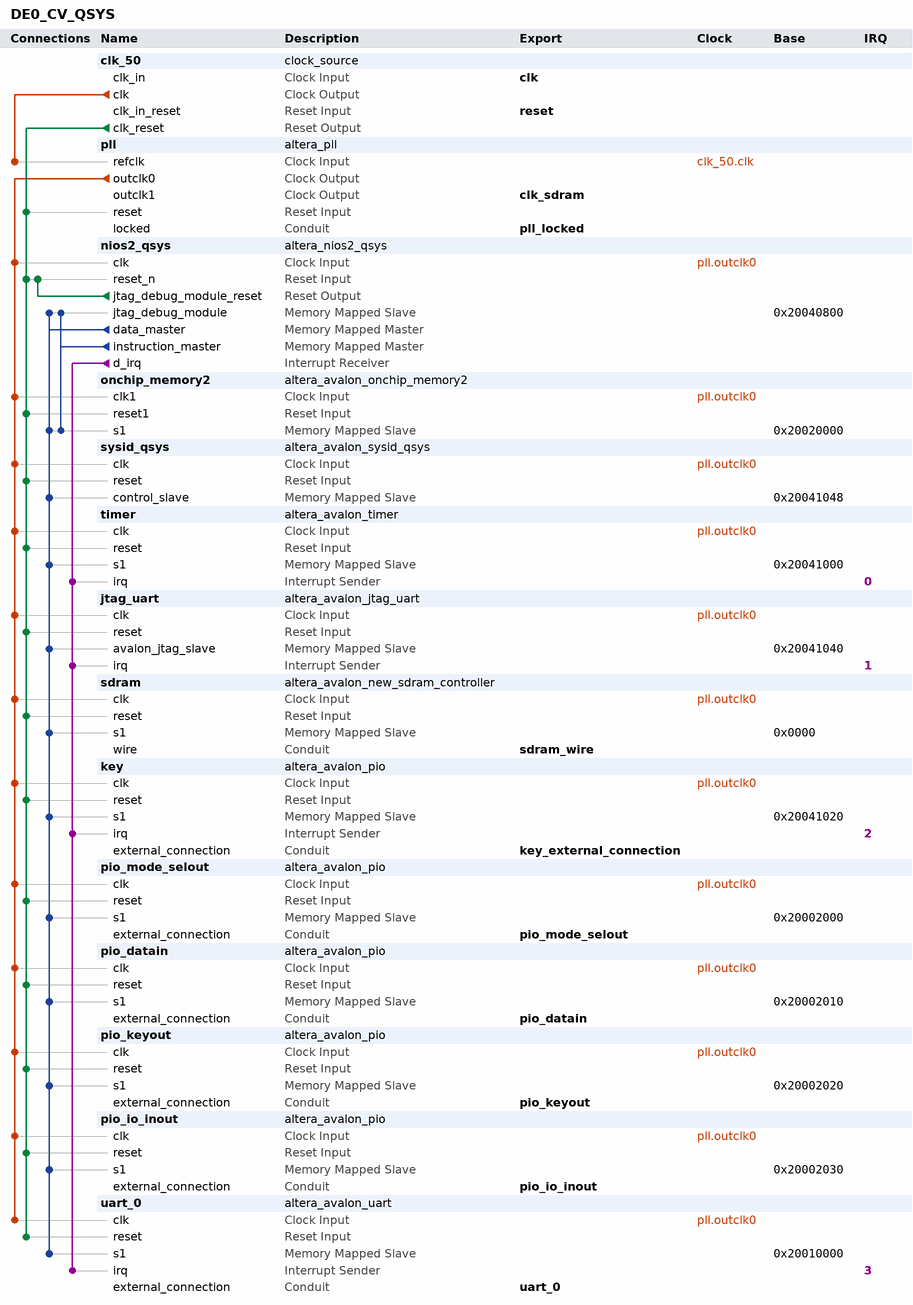
[diagram p0: system contents]
# Platform Designer (Qsys) system DE0_CV_QSYS, Cyclone V 5CEBA4F23C7
# Parameters at their usual value, and those the tool derives, are not listed.
package require -exact qsys 15.1
create_system DE0_CV_QSYS
set_project_property DEVICE_FAMILY {Cyclone V}
set_project_property DEVICE 5CEBA4F23C7

add_instance clk_50 clock_source 15.1
set_instance_parameter_value clk_50 clockFrequency 50000000

add_instance pll altera_pll 15.1
set_instance_parameter_value pll gui_device_speed_grade 2
set_instance_parameter_value pll gui_number_of_clocks 2
set_instance_parameter_value pll gui_operation_mode normal
set_instance_parameter_value pll gui_output_clock_frequency0 143.0
set_instance_parameter_value pll gui_output_clock_frequency1 143.0
set_instance_parameter_value pll gui_phase_shift1 -3800
set_instance_parameter_value pll gui_phase_shift_deg1 -90.0
set_instance_parameter_value pll gui_pll_mode {Integer-N PLL}
set_instance_parameter_value pll gui_reference_clock_frequency 50.0
set_instance_parameter_value pll gui_use_locked true

add_instance nios2_qsys altera_nios2_qsys 15.1
set_instance_parameter_value nios2_qsys breakSlave nios2_qsys.jtag_debug_module
set_instance_parameter_value nios2_qsys exceptionSlave onchip_memory2.s1
set_instance_parameter_value nios2_qsys icache_size 4096
set_instance_parameter_value nios2_qsys impl Tiny
set_instance_parameter_value nios2_qsys mmu_TLBMissExcSlave None
set_instance_parameter_value nios2_qsys resetSlave onchip_memory2.s1
set_instance_parameter_value nios2_qsys resetrequest_enabled true

add_instance onchip_memory2 altera_avalon_onchip_memory2 15.1
set_instance_parameter_value onchip_memory2 dataWidth 32
set_instance_parameter_value onchip_memory2 dualPort false
set_instance_parameter_value onchip_memory2 initMemContent true
set_instance_parameter_value onchip_memory2 initializationFileName onchip_mem.hex
set_instance_parameter_value onchip_memory2 memorySize 128000

add_instance sysid_qsys altera_avalon_sysid_qsys 15.1
set_instance_parameter_value sysid_qsys id 0

add_instance timer altera_avalon_timer 15.1
set_instance_parameter_value timer period 1
set_instance_parameter_value timer periodUnits MSEC

add_instance jtag_uart altera_avalon_jtag_uart 15.1
set_instance_parameter_value jtag_uart simInteractiveOptions NO_INTERACTIVE_WINDOWS

add_instance sdram altera_avalon_new_sdram_controller 15.1
set_instance_parameter_value sdram TAC 5.4
set_instance_parameter_value sdram TRCD 15.0
set_instance_parameter_value sdram TRP 15.0
set_instance_parameter_value sdram casLatency 3
set_instance_parameter_value sdram columnWidth 10
set_instance_parameter_value sdram dataWidth 16
set_instance_parameter_value sdram generateSimulationModel true
set_instance_parameter_value sdram model single_Micron_MT48LC4M32B2_7_chip
set_instance_parameter_value sdram numberOfBanks 4
set_instance_parameter_value sdram numberOfChipSelects 1
set_instance_parameter_value sdram powerUpDelay 100.0
set_instance_parameter_value sdram refreshPeriod 7.8125
set_instance_parameter_value sdram rowWidth 13

add_instance key altera_avalon_pio 15.1
set_instance_parameter_value key captureEdge true
set_instance_parameter_value key direction Input
set_instance_parameter_value key edgeType FALLING
set_instance_parameter_value key generateIRQ true
set_instance_parameter_value key irqType EDGE
set_instance_parameter_value key width 4

add_instance pio_mode_selout altera_avalon_pio 15.1
set_instance_parameter_value pio_mode_selout direction Output
set_instance_parameter_value pio_mode_selout width 3

add_instance pio_datain altera_avalon_pio 15.1
set_instance_parameter_value pio_datain direction Input
set_instance_parameter_value pio_datain width 8

add_instance pio_keyout altera_avalon_pio 15.1
set_instance_parameter_value pio_keyout direction Output
set_instance_parameter_value pio_keyout width 5

add_instance pio_io_inout altera_avalon_pio 15.1
set_instance_parameter_value pio_io_inout direction Output
set_instance_parameter_value pio_io_inout width 9

add_instance uart_0 altera_avalon_uart 15.1
set_instance_parameter_value uart_0 baud 115200
set_instance_parameter_value uart_0 dataBits 8
set_instance_parameter_value uart_0 fixedBaud true
set_instance_parameter_value uart_0 parity NONE
set_instance_parameter_value uart_0 stopBits 1

# connections
add_connection clk_50.clk pll.refclk clock
add_connection pll.outclk0 jtag_uart.clk clock
add_connection pll.outclk0 key.clk clock
add_connection pll.outclk0 nios2_qsys.clk clock
add_connection pll.outclk0 onchip_memory2.clk1 clock
add_connection pll.outclk0 pio_datain.clk clock
add_connection pll.outclk0 pio_io_inout.clk clock
add_connection pll.outclk0 pio_keyout.clk clock
add_connection pll.outclk0 pio_mode_selout.clk clock
add_connection pll.outclk0 sdram.clk clock
add_connection pll.outclk0 sysid_qsys.clk clock
add_connection pll.outclk0 timer.clk clock
add_connection pll.outclk0 uart_0.clk clock
add_connection clk_50.clk_reset jtag_uart.reset reset
add_connection clk_50.clk_reset key.reset reset
add_connection clk_50.clk_reset nios2_qsys.reset_n reset
add_connection clk_50.clk_reset onchip_memory2.reset1 reset
add_connection clk_50.clk_reset pio_datain.reset reset
add_connection clk_50.clk_reset pio_io_inout.reset reset
add_connection clk_50.clk_reset pio_keyout.reset reset
add_connection clk_50.clk_reset pio_mode_selout.reset reset
add_connection clk_50.clk_reset pll.reset reset
add_connection clk_50.clk_reset sdram.reset reset
add_connection clk_50.clk_reset sysid_qsys.reset reset
add_connection clk_50.clk_reset timer.reset reset
add_connection clk_50.clk_reset uart_0.reset reset
add_connection nios2_qsys.jtag_debug_module_reset nios2_qsys.reset_n reset
add_connection nios2_qsys.data_master jtag_uart.avalon_jtag_slave avalon
set_connection_parameter_value nios2_qsys.data_master/jtag_uart.avalon_jtag_slave baseAddress 0x20041040
add_connection nios2_qsys.data_master key.s1 avalon
set_connection_parameter_value nios2_qsys.data_master/key.s1 baseAddress 0x20041020
add_connection nios2_qsys.data_master nios2_qsys.jtag_debug_module avalon
set_connection_parameter_value nios2_qsys.data_master/nios2_qsys.jtag_debug_module baseAddress 0x20040800
add_connection nios2_qsys.data_master onchip_memory2.s1 avalon
set_connection_parameter_value nios2_qsys.data_master/onchip_memory2.s1 baseAddress 0x20020000
add_connection nios2_qsys.data_master pio_datain.s1 avalon
set_connection_parameter_value nios2_qsys.data_master/pio_datain.s1 baseAddress 0x20002010
add_connection nios2_qsys.data_master pio_io_inout.s1 avalon
set_connection_parameter_value nios2_qsys.data_master/pio_io_inout.s1 baseAddress 0x20002030
add_connection nios2_qsys.data_master pio_keyout.s1 avalon
set_connection_parameter_value nios2_qsys.data_master/pio_keyout.s1 baseAddress 0x20002020
add_connection nios2_qsys.data_master pio_mode_selout.s1 avalon
set_connection_parameter_value nios2_qsys.data_master/pio_mode_selout.s1 baseAddress 0x20002000
add_connection nios2_qsys.data_master sdram.s1 avalon
set_connection_parameter_value nios2_qsys.data_master/sdram.s1 baseAddress 0x0000
add_connection nios2_qsys.data_master sysid_qsys.control_slave avalon
set_connection_parameter_value nios2_qsys.data_master/sysid_qsys.control_slave baseAddress 0x20041048
add_connection nios2_qsys.data_master timer.s1 avalon
set_connection_parameter_value nios2_qsys.data_master/timer.s1 baseAddress 0x20041000
add_connection nios2_qsys.data_master uart_0.s1 avalon
set_connection_parameter_value nios2_qsys.data_master/uart_0.s1 baseAddress 0x20010000
add_connection nios2_qsys.instruction_master nios2_qsys.jtag_debug_module avalon
set_connection_parameter_value nios2_qsys.instruction_master/nios2_qsys.jtag_debug_module baseAddress 0x20040800
add_connection nios2_qsys.instruction_master onchip_memory2.s1 avalon
set_connection_parameter_value nios2_qsys.instruction_master/onchip_memory2.s1 baseAddress 0x20020000
add_connection nios2_qsys.d_irq jtag_uart.irq interrupt
set_connection_parameter_value nios2_qsys.d_irq/jtag_uart.irq irqNumber 1
add_connection nios2_qsys.d_irq key.irq interrupt
set_connection_parameter_value nios2_qsys.d_irq/key.irq irqNumber 2
add_connection nios2_qsys.d_irq timer.irq interrupt
set_connection_parameter_value nios2_qsys.d_irq/timer.irq irqNumber 0
add_connection nios2_qsys.d_irq uart_0.irq interrupt
set_connection_parameter_value nios2_qsys.d_irq/uart_0.irq irqNumber 3

# exported interfaces
add_interface clk clock sink
set_interface_property clk EXPORT_OF clk_50.clk_in
add_interface clk_sdram clock source
set_interface_property clk_sdram EXPORT_OF pll.outclk1
add_interface key_external_connection conduit end
set_interface_property key_external_connection EXPORT_OF key.external_connection
add_interface pio_datain conduit end
set_interface_property pio_datain EXPORT_OF pio_datain.external_connection
add_interface pio_io_inout conduit end
set_interface_property pio_io_inout EXPORT_OF pio_io_inout.external_connection
add_interface pio_keyout conduit end
set_interface_property pio_keyout EXPORT_OF pio_keyout.external_connection
add_interface pio_mode_selout conduit end
set_interface_property pio_mode_selout EXPORT_OF pio_mode_selout.external_connection
add_interface pll_locked conduit end
set_interface_property pll_locked EXPORT_OF pll.locked
add_interface reset reset sink
set_interface_property reset EXPORT_OF clk_50.clk_in_reset
add_interface sdram_wire conduit end
set_interface_property sdram_wire EXPORT_OF sdram.wire
add_interface uart_0 conduit end
set_interface_property uart_0 EXPORT_OF uart_0.external_connection

set_interconnect_requirement {$system} qsys_mm.clockCrossingAdapter HANDSHAKE
set_interconnect_requirement {$system} qsys_mm.maxAdditionalLatency 1

save_system DE0_CV_QSYS.qsys
